# EAGLE design LPC_UP_BA_3.43 (EAGLE 5.00)
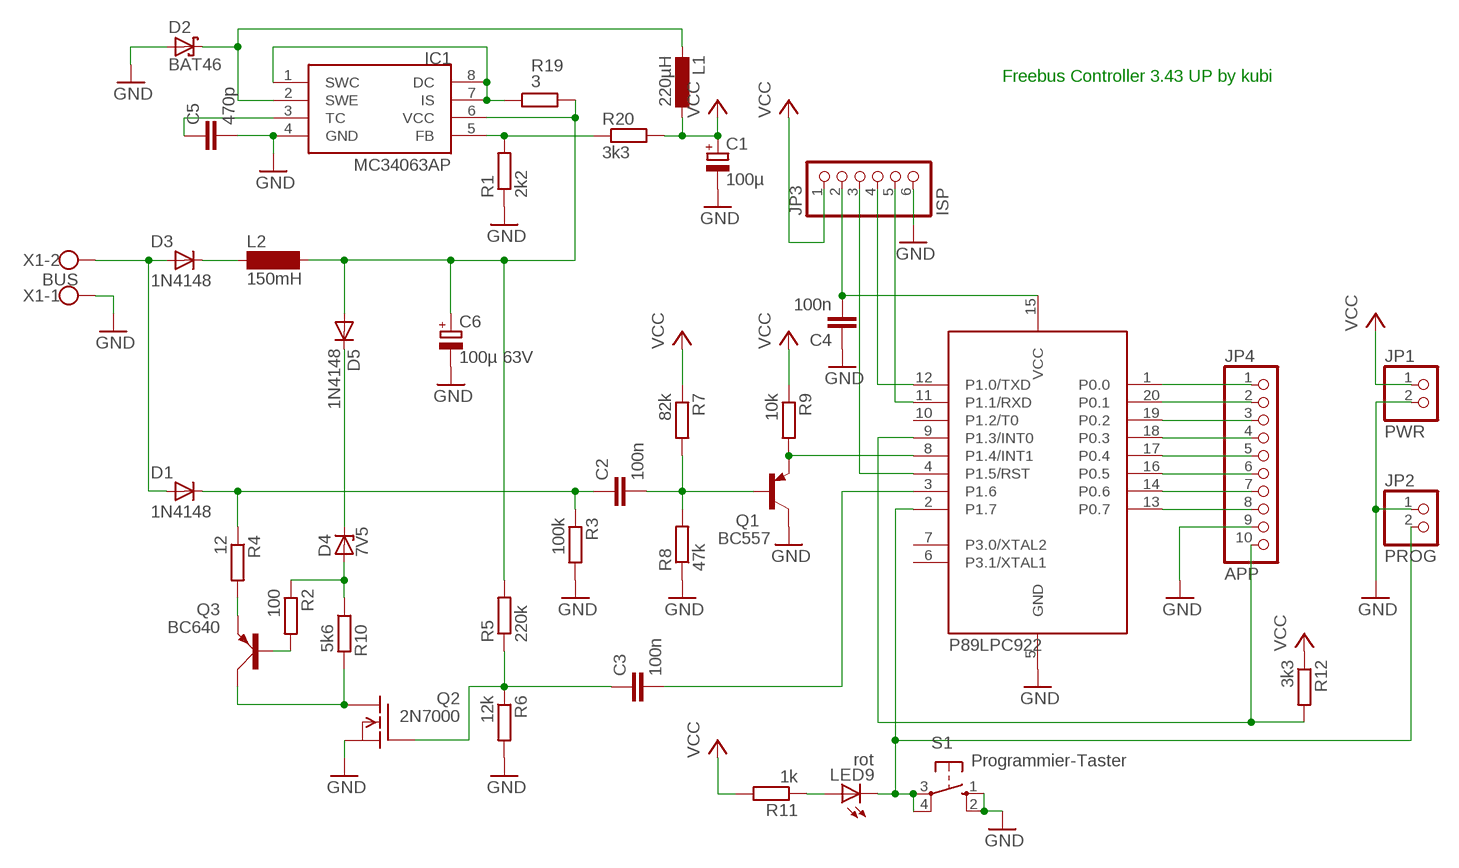
[diagram p0: schematic, sheet 1]

## Parts
C1  100µ  CPOL-EUE5-8.5  [E5-8,5]
C2  100n  C-EU050-024X044  [C050-024X044]
C3  100n  C-EU050-024X044  [C050-024X044]
C4  100n  C-EU050-024X044  [C050-024X044]
C5  470p  C-EU025-024X044  [C025-024X044]
C6  100µ 63V  CPOL-EUE5-8.5  [E5-8,5]
D1  1N4148  DO35-LIEGEND  [DO35-L]
D2  BAT46  BAT49  [DO41-10]
D3  1N4148  DO35-STEHEND  [DO35-S]
D4  7V5  ZPD  [DO35Z10]
D5  1N4148  [DO35-10]
IC1  MC34063AP  [DIL08]
JP1  PWR  PINHD-1X2  [1X02]
JP2  PROG  PINHD-1X2  [1X02]
JP3  ISP  PINHD-1X6  [1X06]
JP4  APP  PINHD-1X10  [1X10]
L1  220µH  L-EU2200-12.7  [2200-12.7]
L2  150mH  SD12K100  [SD12K100]
LED9  rot  LED3MM  [LED3MM]
Q1  BC557  [TO92]
Q2  2N7000  VN2222KM  [TO237]
Q3  BC640  [SOT54D]
R1  2k2  R-EU_0207/2V  [0207/2V]
R2  100  R-EU_0207/2V  [0207/2V]
R3  100k  R-EU_0207/2V  [0207/2V]
R4  12  R-EU_0207/2V  [0207/2V]
R5  220k  R-EU_0207/10  [0207/10]
R6  12k  R-EU_0207/2V  [0207/2V]
R7  82k  R-EU_0207/2V  [0207/2V]
R8  47k  R-EU_0207/2V  [0207/2V]
R9  10k  R-EU_0207/2V  [0207/2V]
R10  5k6  R-EU_0207/2V  [0207/2V]
R11  1k  R-EU_0207/2V  [0207/2V]
R12  3k3  R-EU_0207/2V  [0207/2V]
R19  3  R-EU_0207/2V  [0207/2V]
R20  3k3  R-EU_0207/2V  [0207/2V]
S1  Programmier-Taster  10-XX  [B3F-10XX]
U1  89LPC922  [DIL20]
X1  BUS  W237-02P  [W237-132]

## Nets
GND: C1.- C4.1 C5.2 C6.- D2.A IC1.4(GND) JP1.2 JP2.1 JP3.6 JP4.9 Q1.3(C) Q2.3(S) R1.1 R3.2 R6.2 R8.1 S1.1(S) S1.2(S1) U1.5(GND) X1.1
N$1: Q1.1(E) R9.2 U1.8(P1.4/INT1)
N$2: C2.2 Q1.2(B) R7.2 R8.2
N$3: IC1.5(FB) R1.2 R20.1
N$4: IC1.1(SWC) IC1.7(IS) IC1.8(DC) R19.1
N$5: C3.2 U1.3(P1.6)
N$6: Q2.1(D) Q3.C R10.2
N$7: C6.+ D5.A IC1.6(VCC) L2.2 R5.2 R19.2
N$8: D3.P$2(B) L2.1
N$9: C2.1 D1.P$2(B) R3.1 R4.1
N$10: D2.C IC1.2(SWE) L1.2
N$11: D4.A R2.1 R10.1
N$12: Q3.E R4.2
N$13: C5.1 IC1.3(TC)
N$14: Q3.B R2.2
N$15: D1.P$1(A) D3.P$1(A) X1.2
N$16: JP4.10 R12.2 U1.9(P1.3/INT0)
N$17: JP2.2 LED9.K(C) S1.3(P) S1.4(P1) U1.2(P1.7)
N$29: JP3.4 U1.12(P1.0/TXD)
N$30: JP3.5 U1.11(P1.1/RXD)
N$31: JP3.3 U1.4(P1.5/RST)
N$32: C4.2 JP3.2 U1.15(VCC)
N$34: C3.1 Q2.2(G) R5.1 R6.1
N$40: D4.C D5.C
N$41: LED9.A R11.1
P0.0: JP4.1 U1.1(P0.0)
P0.1: JP4.2 U1.20(P0.1)
P0.2: JP4.3 U1.19(P0.2)
P0.3: JP4.4 U1.18(P0.3)
P0.4: JP4.5 U1.17(P0.4)
P0.5: JP4.6 U1.16(P0.5)
P0.6: JP4.7 U1.14(P0.6)
P0.7: JP4.8 U1.13(P0.7)
VCC: C1.+ JP1.1 JP3.1 L1.1 R7.1 R9.1 R11.2 R12.1 R20.2
Unconnected: U1.6(P3.1/XTAL1) U1.7(P3.0/XTAL2) U1.10(P1.2/T0)

## Notes on the sheet
- Freebus Controller 3.43 UP by kubi
- P89LPC922

## Library data of the parts
C1 C6 = rcl:CPOL-EU: POLARIZED CAPACITOR, European symbol
C2-C5 = rcl:C-EU: CAPACITOR, European symbol
D1 = kubi:DO35-LIEGEND
D2 = diode:BAT49: DIODE small signal diode
D3 = kubi:DO35-STEHEND
D4 = diode:ZPD: Z DIODE 500 mW
D5 = diode:1N4148: DIODE high speed (Philips)
IC1 = mc34063:MC34063
JP1 JP2 = pinhead:PINHD-1X2: PIN HEADER
JP3 = pinhead:PINHD-1X6: PIN HEADER
JP4 = pinhead:PINHD-1X10: PIN HEADER
L1 = rcl:L-EU: INDUCTOR, European symbol
L2 = inductor-neosid:SD12: INDUCTOR nominal inductance
LED9 = led:LED: LED OSRAM: - CHIPLED LG R971, LG N971, LY N971, LG Q971, LY Q971, LO R971, LY R971 LH N974, LH R974 LS Q976, LO Q976, LY Q976 LO Q996 - Hyper CHIPLED LW Q18S LB Q993, LB Q99A, LB R99A - SideLED LS A670, LO A670, LY A670, LG A670, LP A670 LB A673, LV A673, LT A673, LW A673 LH A674 LY A675 LS A676, LA A676, LO A676, LY A676, LW A676 LS A679, LY A679, LG A679 - Hyper Micro SIDELED® LS Y876, LA Y876, LO Y876, LY Y876 LT Y87S - SmartLED LW L88C, LW L88S LB L89C, LB L89S, LG L890 LS L89K, LO L89K, LY L89K LS L896, LA L896, LO L896, LY L896 - TOPLED LS T670, LO T670, LY T670, LG T670, LP T670 LSG T670, LSP T670, LSY T670, LOP T670, LYG T670 LG T671, LOG T671, LSG T671 LB T673, LV T673, LT T673, LW T673 LH T674 LS T676, LA T676, LO T676, LY T676, LB T676, LH T676, LSB T676, LW T676 LB T67C, LV T67C, LT T67C, LS T67K, LO T67K, LY T67K, LW E67C LS E67B, LA E67B, LO E67B, LY E67B, LB E67C, LV E67C, LT E67C LW T67C LS T679, LY T679, LG T679 LS T770, LO T770, LY T770, LG T770, LP T770 LB T773, LV T773, LT T773, LW T773 LH T774 LS E675, LA E675, LY E675, LS T675 LS T776, LA T776, LO T776, LY T776, LB T776 LHGB T686 LT T68C, LB T68C - Hyper Mini TOPLED® LB M676 - Mini TOPLED Santana® LG M470 LS M47K, LO M47K, LY M47K Source: http://www.osram.convergy.de - LUMILED® LXK2-PW12-R00, LXK2-PW12-S00, LXK2-PW14-U00, LXK2-PW14-V00 LXK2-PM12-R00, LXK2-PM12-S00, LXK2-PM14-U00 LXK2-PE12-Q00, LXK2-PE12-R00, LXK2-PE12-S00, LXK2-PE14-T00, LXK2-PE14-U00 LXK2-PB12-K00, LXK2-PB12-L00, LXK2-PB12-M00, LXK2-PB14-N00, LXK2-PB14-P00, LXK2-PB14-Q00 LXK2-PR12-L00, LXK2-PR12-M00, LXK2-PR14-Q00, LXK2-PR14-R00 LXK2-PD12-Q00, LXK2-PD12-R00, LXK2-PD12-S00 LXK2-PH12-R00, LXK2-PH12-S00 LXK2-PL12-P00, LXK2-PL12-Q00, LXK2-PL12-R00 Source: www.luxeon.com
Q1 = transistor-pnp:BC557: PNP Transistor
Q2 = transistor-fet:VN2222KM: N-Channel Enhancement MOSFET (VMOS); 60V; 0,5A; 7,5Ohm
Q3 = transistor-small-signal:BC640: PNP TRANSISTOR
R1-R12 R19 R20 = rcl:R-EU_: RESISTOR, European symbol
S1 = switch-omron:10-XX: OMRON SWITCH
U1 = micro-philips:89LPC922
X1 = con-wago-508:W237-02P: WAGO SREW CLAMP

## Board
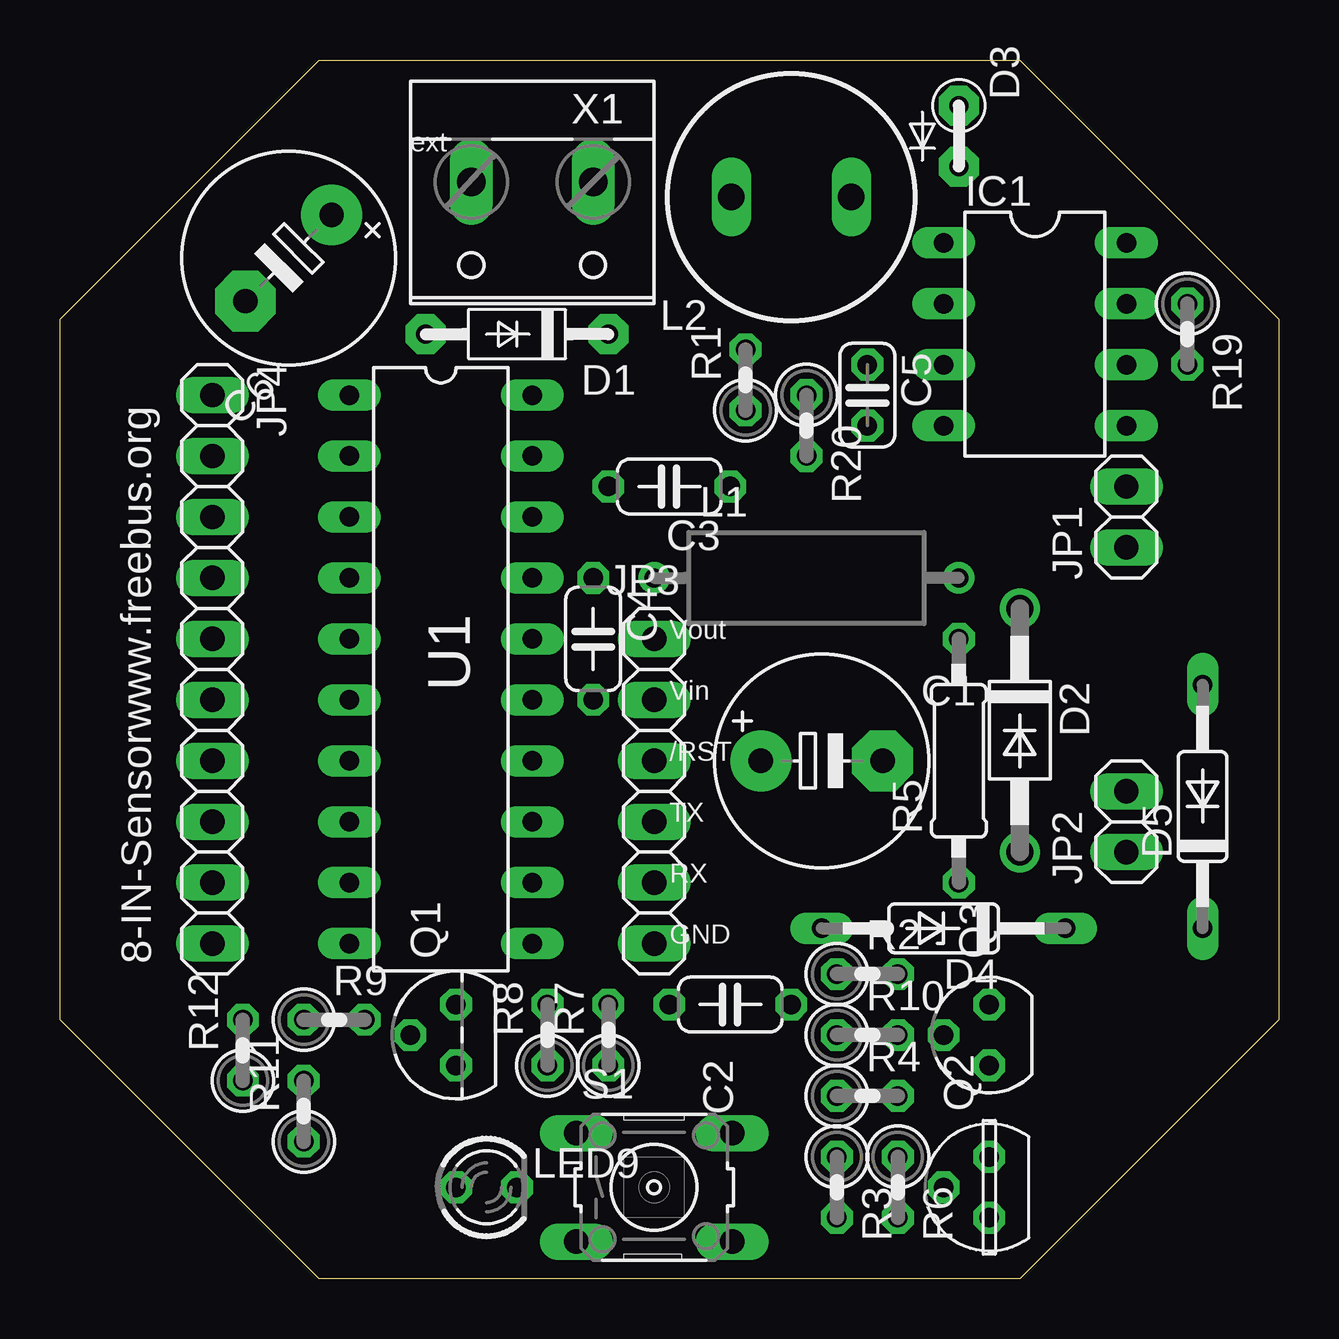
[diagram p1: board, top side]
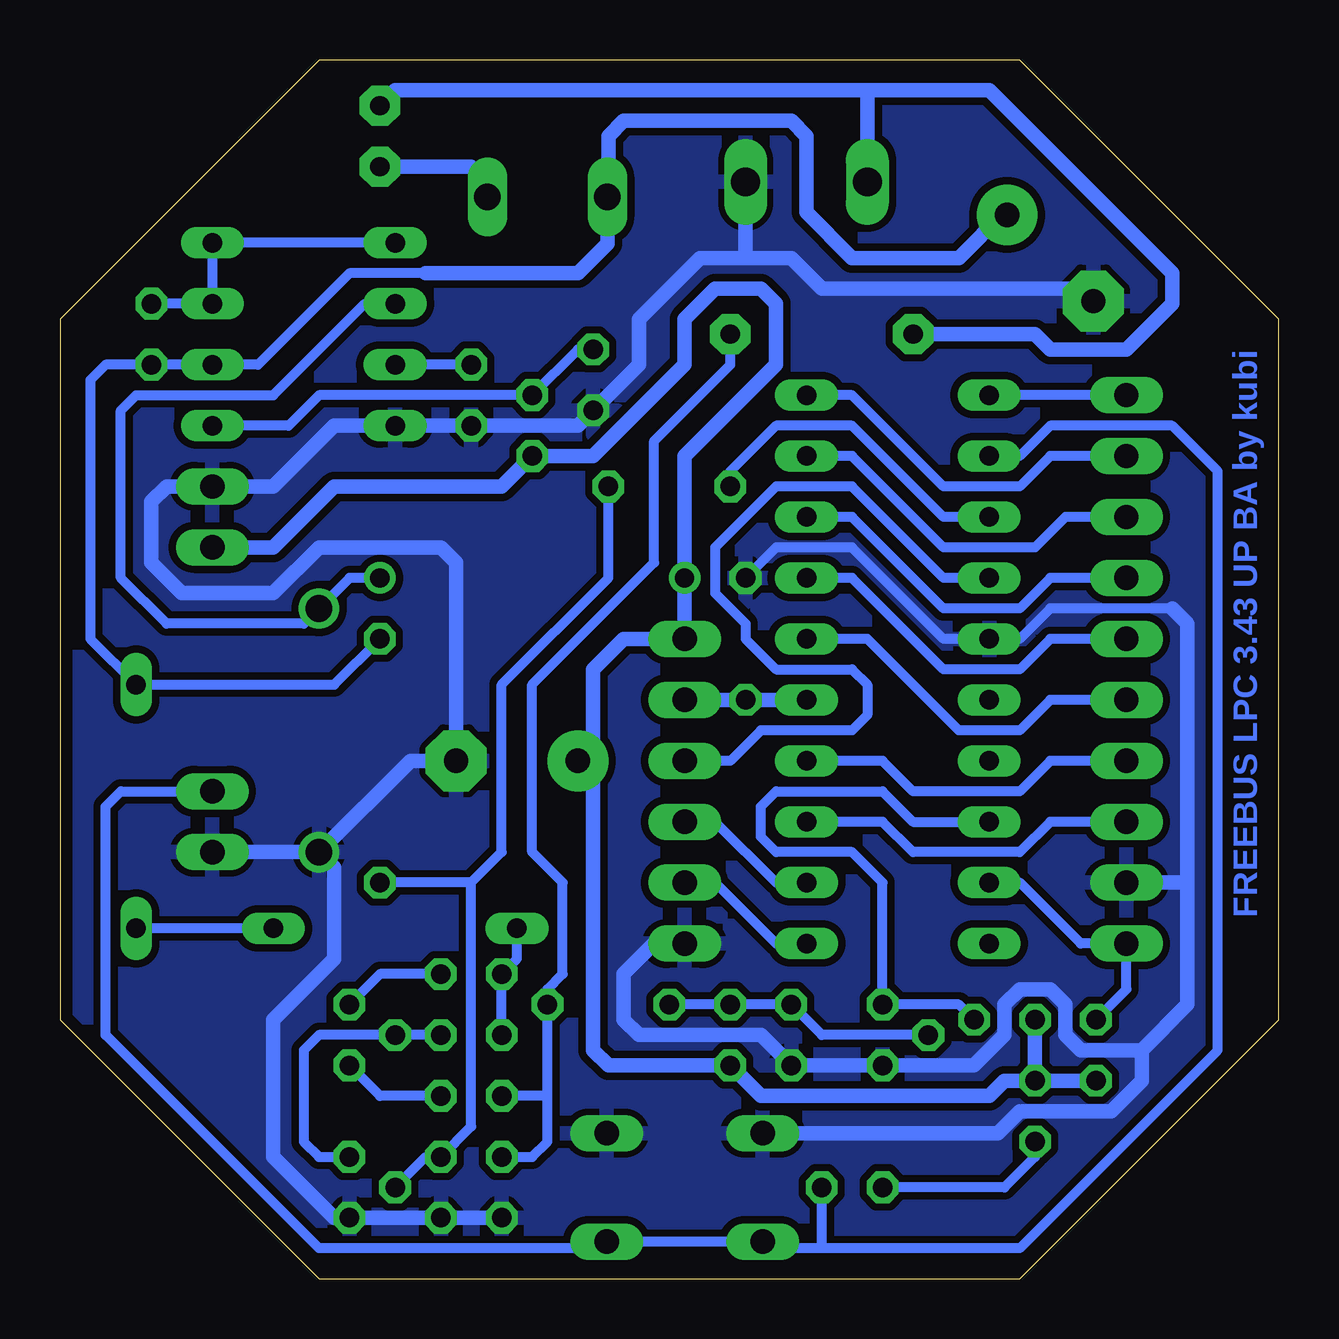
[diagram p2: board, bottom side, seen from below]

Size 50.8 x 50.8 mm. Coordinates in mm from the lower left corner, seen from the top.
Outline: 10.79,0 0,10.79 0,40.01 10.79,50.8 40.01,50.8 50.8,40.01 50.8,10.79 40.01,0 10.79,0
Copper layers (1*16): Top 0.035mm / dielectric 1.5mm / Bottom 0.035mm
Design rules "default *": minimum track width 10mil, minimum drill 24mil, track to track 12mil, track to pad 12mil, pad to pad 12mil, via to via 12mil, smd to smd 8mil, copper to edge 20mil, drill to drill 8mil, minimum pad ring 10mil, minimum via ring 8mil, stop-mask expansion 4mil, vias tented up to drill 0mil, thermal gap 10mil

### Footprints (pad centres in the part's own frame; a part is rotated, then mirrored left to right if it is on the bottom)
E5-8,5 = drill 1.016 pad 2.54 round: + -2.54,0 | drill 1.016 pad 2.54 octagon: - 2.54,0
C050-024X044 = drill 0.813 octagon: 1 -2.54,0; 2 2.54,0
C025-024X044 = drill 0.813 octagon: 1 -1.27,0; 2 1.27,0
DO35-L = drill 0.8 pad 1.676 octagon: P$1 -3.81,0; P$2 3.81,0
DO41-10 = drill 1.118 round: A 5.08,0; C -5.08,0
DO35-S = drill 0.8 pad 1.676 octagon: P$1 -1.27,0; P$2 1.27,0
DO35Z10 = drill 0.813 long: A 5.08,0; C -5.08,0
DO35-10 = drill 0.813 long: A 5.08,0; C -5.08,0
DIL08 = drill 0.813 long: 1 -3.81,-3.81; 2 -1.27,-3.81; 3 1.27,-3.81; 4 3.81,-3.81; 5 3.81,3.81; 6 1.27,3.81; 7 -1.27,3.81; 8 -3.81,3.81
1X02 = drill 1.016 long: 1 -1.27,0; 2 1.27,0
1X06 = drill 1.016 long: 1 -6.35,0; 2 -3.81,0; 3 -1.27,0; 4 1.27,0; 5 3.81,0; 6 6.35,0
1X10 = drill 1.016 long: 1 -11.43,0; 2 -8.89,0; 3 -6.35,0; 4 -3.81,0; 5 -1.27,0; 6 1.27,0; 7 3.81,0; 8 6.35,0; 9 8.89,0; 10 11.43,0
2200-12.7 = drill 0.8 pad 1.27 round: 1 -6.35,0; 2 6.35,0
SD12K100 = drill 1.1 long: 1 -2.5,0; 2 2.5,0
LED3MM = drill 0.813 octagon: A -1.27,0; K 1.27,0
TO92 = drill 0.813 octagon: 1 1.27,0; 2 0,1.905; 3 -1.27,0
TO237 = drill 0.813 octagon: 1 1.27,0; 2 0,1.905; 3 -1.27,0
SOT54D = drill 0.813 octagon: B 1.27,0; C 0,1.905; E -1.27,0
0207/2V = drill 0.813 octagon: 1 -1.27,0; 2 1.27,0
0207/10 = drill 0.813 octagon: 1 -5.08,0; 2 5.08,0
B3F-10XX = drill 1.016 long: 1 -3.251,2.261; 2 3.251,2.261; 3 -3.251,-2.261; 4 3.251,-2.261
DIL20 = drill 0.813 long: 1 -11.43,-3.81; 2 -8.89,-3.81; 3 -6.35,-3.81; 4 -3.81,-3.81; 5 -1.27,-3.81; 6 1.27,-3.81; 7 3.81,-3.81; 8 6.35,-3.81; 9 8.89,-3.81; 10 11.43,-3.81; 11 11.43,3.81; 12 8.89,3.81; 13 6.35,3.81; 14 3.81,3.81; 15 1.27,3.81; 16 -1.27,3.81; 17 -3.81,3.81; 18 -6.35,3.81; 19 -8.89,3.81; 20 -11.43,3.81
W237-132 = drill 1.194 long: 1 -2.54,-0.635; 2 2.54,-0.635

### Placement (x,y rotation side)
C1  31.75,21.59 0 top
C2  27.94,11.43 180 top
C3  25.4,33.02 180 top
C4  22.23,26.67 270 top
C5  33.66,36.83 270 top
C6  9.53,42.55 225 top
D1  19.05,39.37 0 top
D2  40.01,22.86 270 top
D3  37.47,47.62 270 top
D4  36.83,14.61 180 top
D5  47.62,19.68 90 top
IC1  40.64,39.37 270 top
JP1  44.45,31.75 90 top
JP2  44.45,19.05 90 top
JP3  24.77,20.32 270 top
JP4  6.35,25.4 270 top
L1  31.11,29.21 0 top
L2  30.48,45.09 180 top
LED9  17.78,3.81 0 top
Q1  16.51,10.16 90 top
Q2  38.73,3.81 90 top
Q3  38.73,10.16 90 top
R1  28.57,37.47 90 top
R2  33.66,12.7 0 top
R3  32.38,3.81 270 top
R4  33.66,7.62 0 top
R5  37.47,21.59 90 top
R6  34.92,3.81 270 top
R7  22.86,10.16 90 top
R8  20.32,10.16 90 top
R9  11.43,10.79 0 top
R10  33.66,10.16 0 top
R11  10.16,6.99 90 top
R12  7.62,9.53 90 top
R19  46.99,39.37 270 top
R20  31.11,35.56 270 top
S1  24.77,3.81 0 top
U1  15.88,25.4 270 top
X1  19.68,45.09 180 top

### Tracks (layer width: path | path; a pad name or v marks a point on that pad's centre or on a via)
GND
  Bottom 0.406: C4.1 20.95,30.48 17.78,30.48 13.97,26.67 U1.5 10.79,26.67 9.53,27.94 4.45,27.94
  Bottom 0.61: S1.1 11.71,6.07 10.79,6.99 6.99,6.99 5.71,8.26 5.71,9.53 | JP3.6 26.04,13.97 27.3,12.7 27.3,10.79 26.67,10.16 21.59,10.16 R8.1 Q1.3 12.7,8.89 11.43,10.16 11.43,11.43 10.79,12.06 9.53,12.06 8.89,11.43 8.89,10.16 8.26,9.53 5.71,9.53 | R3.2 R6.2 Q2.3 39.37,2.54 41.91,5.08 41.91,10.79 39.37,13.34 39.37,17.14 D2.A | 22.23,42.55 20.32,42.55 19.05,41.27 8.26,41.27 C6.- 7.62,40.64 | 22.23,42.55 X1.1 | D2.A 36.2,21.59 C1.- 34.29,29.84 34.92,30.48 40.01,30.48 41.91,28.57 45.72,28.57 46.99,29.84 46.99,32.38 46.35,33.02 JP1.2 41.91,33.02 39.37,35.56 IC1.4 C5.2 29.21,35.56 R1.1 26.67,38.1 26.67,40.01 24.13,42.55 22.23,42.55 | D2.A JP2.1 | 4.45,27.94 3.81,27.3 3.81,16.51 | 3.81,16.51 JP4.9 | 5.71,9.53 3.81,11.43 3.81,16.51
  pour Bottom: 0,10.79 0,40.01 10.79,50.8 40.01,50.8 50.8,40.01 50.8,10.79 40.01,0 10.79,0
N$1
  Bottom 0.406: U1.8 15.24,19.05 16.51,20.32 20.95,20.32 21.59,19.68 21.59,18.41 20.95,17.78 17.78,17.78 16.51,16.51 Q1.1 13.34,11.43 R9.2
N$2
  Bottom 0.406: Q1.2 19.05,10.16 R8.2 R7.2 C2.2
N$3
  Bottom 0.406: IC1.5 41.27,35.56 40.01,36.83 R20.1 29.21,38.73 R1.2
N$4
  Bottom 0.406: IC1.1 IC1.8 IC1.7 R19.1
N$5
  Bottom 0.406: U1.3 13.97,31.75 17.78,35.56 20.95,35.56 22.86,33.66 C3.2
N$6
  Bottom 0.406: Q2.1 40.01,5.08 40.64,5.71 40.64,9.53 40.01,10.16 Q3.C R10.2
N$7
  Bottom 0.406: R5.2 39.37,24.77 D5.A 49.53,26.67 49.53,37.47 48.9,38.1 R19.2 IC1.6 42.55,38.1 38.73,41.91 35.56,41.91
  Bottom 0.61: C6.+ 11.43,44.45 13.34,42.55 17.78,42.55 19.68,44.45 19.68,47.62 20.32,48.26 27.3,48.26 27.94,47.62 27.94,45.09 L2.2 27.98,43.14 29.21,41.91 35.56,41.91
N$8
  Bottom 0.61: L2.1 32.98,45.68 33.66,46.35 D3.P$2
N$9
  Bottom 0.406: 30.48,7.62 30.48,5.71 31.11,5.08 R3.1 | 30.48,7.62 R4.1 | 30.48,7.62 C2.1 30.48,12.06 29.84,12.7 29.84,16.51 31.11,17.78 31.11,24.77 26.04,29.84 26.04,34.92 22.86,38.1 D1.P$2
N$10
  Bottom 0.406: IC1.2 38.1,40.64 41.91,36.83 47.62,36.83 48.26,36.2 48.26,29.21 46.35,27.3 40.64,27.3 D2.C 38.73,29.21 L1.2
N$11
  Bottom 0.406: R10.1 R2.1 31.75,13.34 D4.A
N$12
  Bottom 0.406: R4.2 37.47,7.62 Q3.E
N$13
  Bottom 0.406: C5.1 IC1.3
N$14
  Bottom 0.406: R2.2 37.47,12.7 Q3.B
N$15
  Bottom 0.61: D1.P$1 10.16,39.37 9.53,38.73 6.35,38.73 4.45,40.64 4.45,41.91 12.06,49.53 17.14,49.53 | D3.P$1 36.83,49.53 17.14,49.53 | 17.14,49.53 X1.2
N$16
  Bottom 0.406: U1.9 10.79,16.51 8.26,13.97 JP4.10 6.35,12.06 R12.2
N$17
  Bottom 0.406: JP2.2 48.26,20.32 48.9,19.68 48.9,10.16 40.01,1.27 27.94,1.27 28.02,1.35 S1.4 21.87,1.55 21.59,1.27 | U1.2 10.79,34.29 9.53,35.56 4.45,35.56 2.54,33.66 2.54,9.53 10.79,1.27 19.05,1.27 | 21.59,1.27 21.51,1.35 S1.3 | 19.05,1.27 21.59,1.27 | 19.05,1.27 LED9.K
N$29
  Bottom 0.406: U1.12 20.95,16.51 23.5,19.05 JP3.4
N$30
  Bottom 0.406: U1.11 20.95,13.97 23.5,16.51 JP3.5
N$31
  Bottom 0.406: U1.4 13.97,29.21 17.78,33.02 20.95,33.02 23.5,30.48 23.5,28.57 22.23,27.3 22.23,26.67 20.95,25.4 17.78,25.4 17.14,24.77 17.14,23.5 17.78,22.86 21.59,22.86 22.86,21.59 JP3.3
N$32
  Bottom 0.61: U1.15 C4.2 JP3.2
N$34
  Bottom 0.406: Q2.2 35.56,5.08 R6.1 33.66,6.35 33.66,16.51 | 33.66,16.51 32.38,17.78 32.38,24.77 27.94,29.21 C3.1 | 33.66,16.51 R5.1
N$40
  Bottom 0.406: D4.C D5.C
N$41
  Bottom 0.406: R11.1 10.16,5.08 11.43,3.81 LED9.A
P0.0
  Bottom 0.406: JP4.1 U1.1
P0.1
  Bottom 0.406: U1.20 17.78,36.83 13.97,33.02 10.79,33.02 9.53,34.29 JP4.2
P0.2
  Bottom 0.406: U1.19 17.78,34.29 13.97,30.48 10.16,30.48 8.89,31.75 JP4.3
P0.3
  Bottom 0.406: U1.18 17.78,31.75 13.97,27.94 10.79,27.94 9.53,29.21 JP4.4
P0.4
  Bottom 0.406: U1.17 17.78,29.21 13.97,25.4 10.79,25.4 9.53,26.67 JP4.5
P0.5
  Bottom 0.406: U1.16 17.14,26.67 13.34,22.86 10.79,22.86 9.53,24.13 JP4.6
P0.6
  Bottom 0.406: U1.14 16.51,21.59 15.24,20.32 10.79,20.32 9.53,21.59 JP4.7
P0.7
  Bottom 0.406: U1.13 16.51,19.05 15.24,17.78 10.79,17.78 9.53,19.05 JP4.8
VCC
  Bottom 0.61: R11.2 11.43,8.26 12.06,7.62 21.59,7.62 R7.1 27.94,8.89 28.57,9.53 28.57,21.59 | R11.2 R9.1 | 28.57,21.59 28.57,25.4 27.3,26.67 JP3.1 L1.1 24.77,34.29 20.95,38.1 20.95,40.64 21.59,41.27 23.5,41.27 24.77,40.01 24.77,38.1 28.57,34.29 R20.2 32.38,33.02 39.37,33.02 41.91,30.48 JP1.1 | 28.57,21.59 C1.+ | R12.1 R11.2

### Text on the board
Bottom: FREEBUS LPC 3.43 UP BA by kubi
tPlace: ext | Vout | Vin | /RST | TX | RX | GND
tNames: 8-IN-Sensor | www.freebus.org